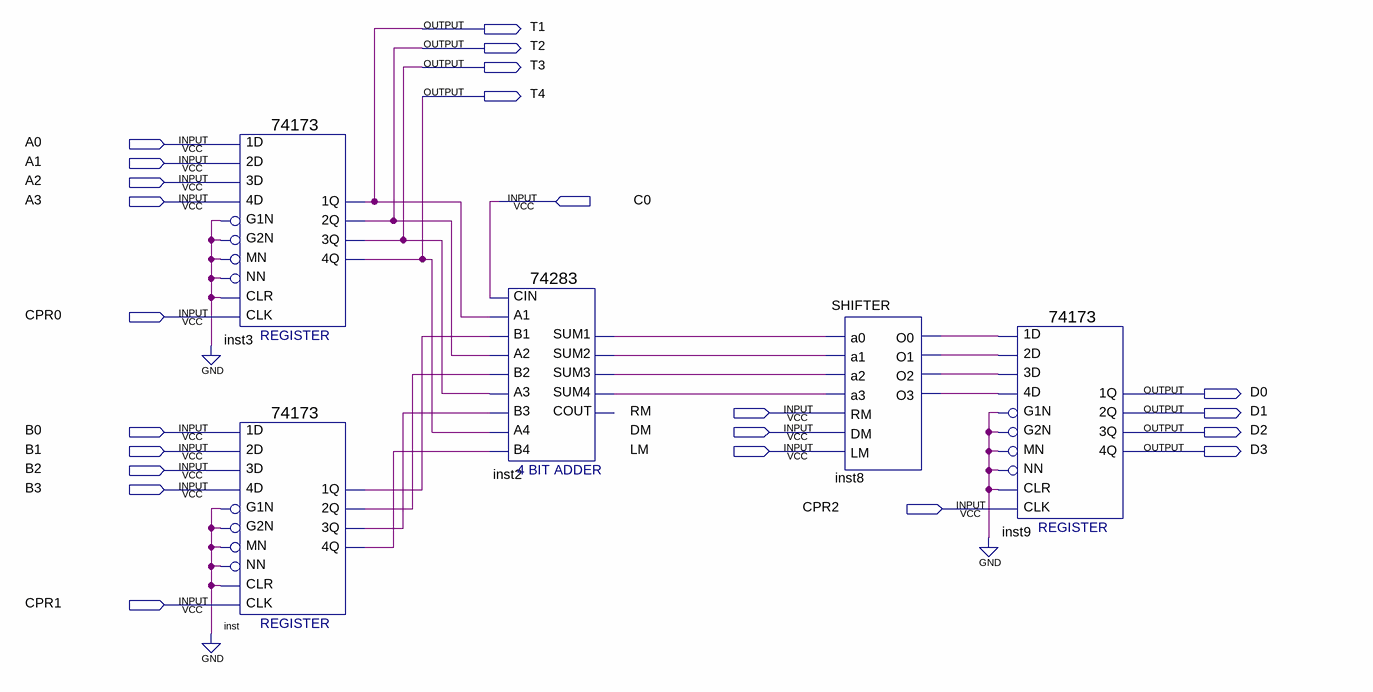
[diagram p0: schematic sheet]
// Quartus schematic COADEXP2.bdf as structural Verilog: 5 symbols, 23 pins
module COADEXP2 (
  input  A0,
  input  A1,
  input  A2,
  input  A3,
  input  C0,
  input  CPR0,
  input  RM,
  input  B0,
  input  DM,
  input  B1,
  input  LM,
  input  B2,
  input  B3,
  input  CPR2,
  input  CPR1,
  output T1,
  output T2,
  output T3,
  output T4,
  output D0,
  output D1,
  output D2,
  output D3
);

  wire inst2_sum1, inst2_sum2, inst2_sum3, inst2_sum4, inst8_o0, inst8_o1, inst8_o2, inst8_o3, inst_1q,
       inst_2q, inst_3q, inst_4q;

  \74173  inst3 (
    .\3D (A2), .MN(1'b0), .\1D (A0), .\2D (A1), .\4D (A3), .G1N(1'b0), .G2N(1'b0), .NN(1'b0), .CLR(1'b0),
    .CLK(CPR0), .\3Q (T3), .\2Q (T2), .\1Q (T1), .\4Q (T4));
  \74173  inst (
    .\3D (B2), .MN(1'b0), .\1D (B0), .\2D (B1), .\4D (B3), .G1N(1'b0), .G2N(1'b0), .NN(1'b0), .CLR(1'b0),
    .CLK(CPR1), .\3Q (inst_3q), .\2Q (inst_2q), .\1Q (inst_1q), .\4Q (inst_4q));
  \74283  inst2 (
    .CIN(C0), .A1(T1), .A2(T2), .B2(inst_2q), .A3(T3), .A4(T4), .B4(inst_4q), .B1(inst_1q), .B3(inst_3q),
    .SUM4(inst2_sum4), .SUM1(inst2_sum1), .SUM2(inst2_sum2), .SUM3(inst2_sum3));  // open: COUT
  SHIFTER inst8 (
    .a0(inst2_sum1), .a1(inst2_sum2), .a2(inst2_sum3), .a3(inst2_sum4), .RM(RM), .DM(DM), .LM(LM),
    .O0(inst8_o0), .O1(inst8_o1), .O2(inst8_o2), .O3(inst8_o3));
  \74173  inst9 (
    .\3D (inst8_o2), .MN(1'b0), .\1D (inst8_o0), .\2D (inst8_o1), .\4D (inst8_o3), .G1N(1'b0), .G2N(1'b0),
    .NN(1'b0), .CLR(1'b0), .CLK(CPR2), .\3Q (D2), .\2Q (D1), .\1Q (D0), .\4Q (D3));
endmodule
